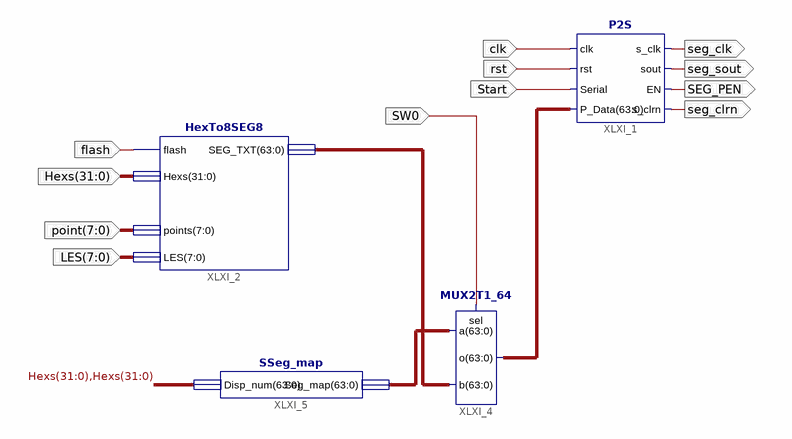
[diagram p0: schematic sheet 1]
// Xilinx ISE schematic Display.sch (kintex7) as structural Verilog: 4 symbols, 12 ports
module Display (
  input  [7:0] LES,
  input  [7:0] point,
  input  [31:0] Hexs,
  input  flash,
  input  clk,
  input  rst,
  input  Start,
  input  SW0,
  output seg_clk,
  output seg_sout,
  output SEG_PEN,
  output seg_clrn
);

  wire [63:0] XLXN_14, XLXN_15, XLXN_16;

  P2S XLXI_1 (
    .s_clrn(seg_clrn), .sout(seg_sout), .rst(rst), .EN(SEG_PEN), .Serial(Start), .clk(clk), .s_clk(seg_clk),
    .P_Data(XLXN_14));
  HexTo8SEG8 XLXI_2 (.flash(flash), .Hexs(Hexs), .points(point), .LES(LES), .SEG_TXT(XLXN_16));
  MUX2T1_64 XLXI_4 (.b(XLXN_16), .sel(SW0), .a(XLXN_15), .o(XLXN_14));
  SSeg_map XLXI_5 (.Disp_num({Hexs, Hexs}), .Seg_map(XLXN_15));
endmodule
